# EAGLE schematic led (EAGLE 9.6.2)
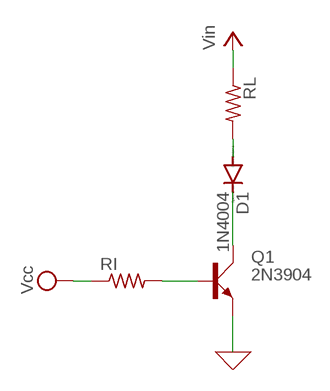
[diagram p0: schematic, sheet 1]

## Parts
D1  1N4004  [DO41-10]
Q1  2N3904  [TO92D]
RI  R-US_0204/7  [0204/7]
RL  R-US_0204/7  [0204/7]

## Nets
0: Q1.E ; supply symbol labelled GND
N$1: D1.A RL.2
N$2: D1.C Q1.C
N$3: Q1.B RI.2
VCC: RI.1 RL.1 ; supply symbol labelled Vin, Vcc

## Library data of the parts
D1 = diode:1N4004: DIODE general purpose rectifier, 1 A
Q1 = transistor-small-signal:2N3904: NPN TRANSISTOR
RI RL = rcl:R-US_: RESISTOR, American symbol; SPICEPREFIX: R